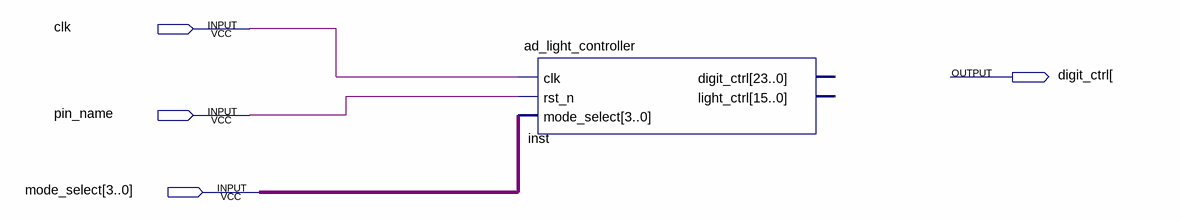
[diagram p0: schematic sheet]
// Quartus schematic ad_light_controller.bdf as structural Verilog: 1 symbols, 4 pins
module ad_light_controller (
  input  clk,
  input  pin_name,
  input  [3:0] mode_select,
  output \digit_ctrl[ 
);

  ad_light_controller inst (.clk(clk), .rst_n(pin_name), .mode_select(mode_select));  // open: digit_ctrl, light_ctrl
endmodule
